# EasyEDA schematic SCH_Party-Lights_2024-05-11.json
TITLE: Sheet_1; REV: 1.0; Date: 2024-04-14; Sheet: 1/1; Drawn By: saisiddharthgiis; Company: Your Company
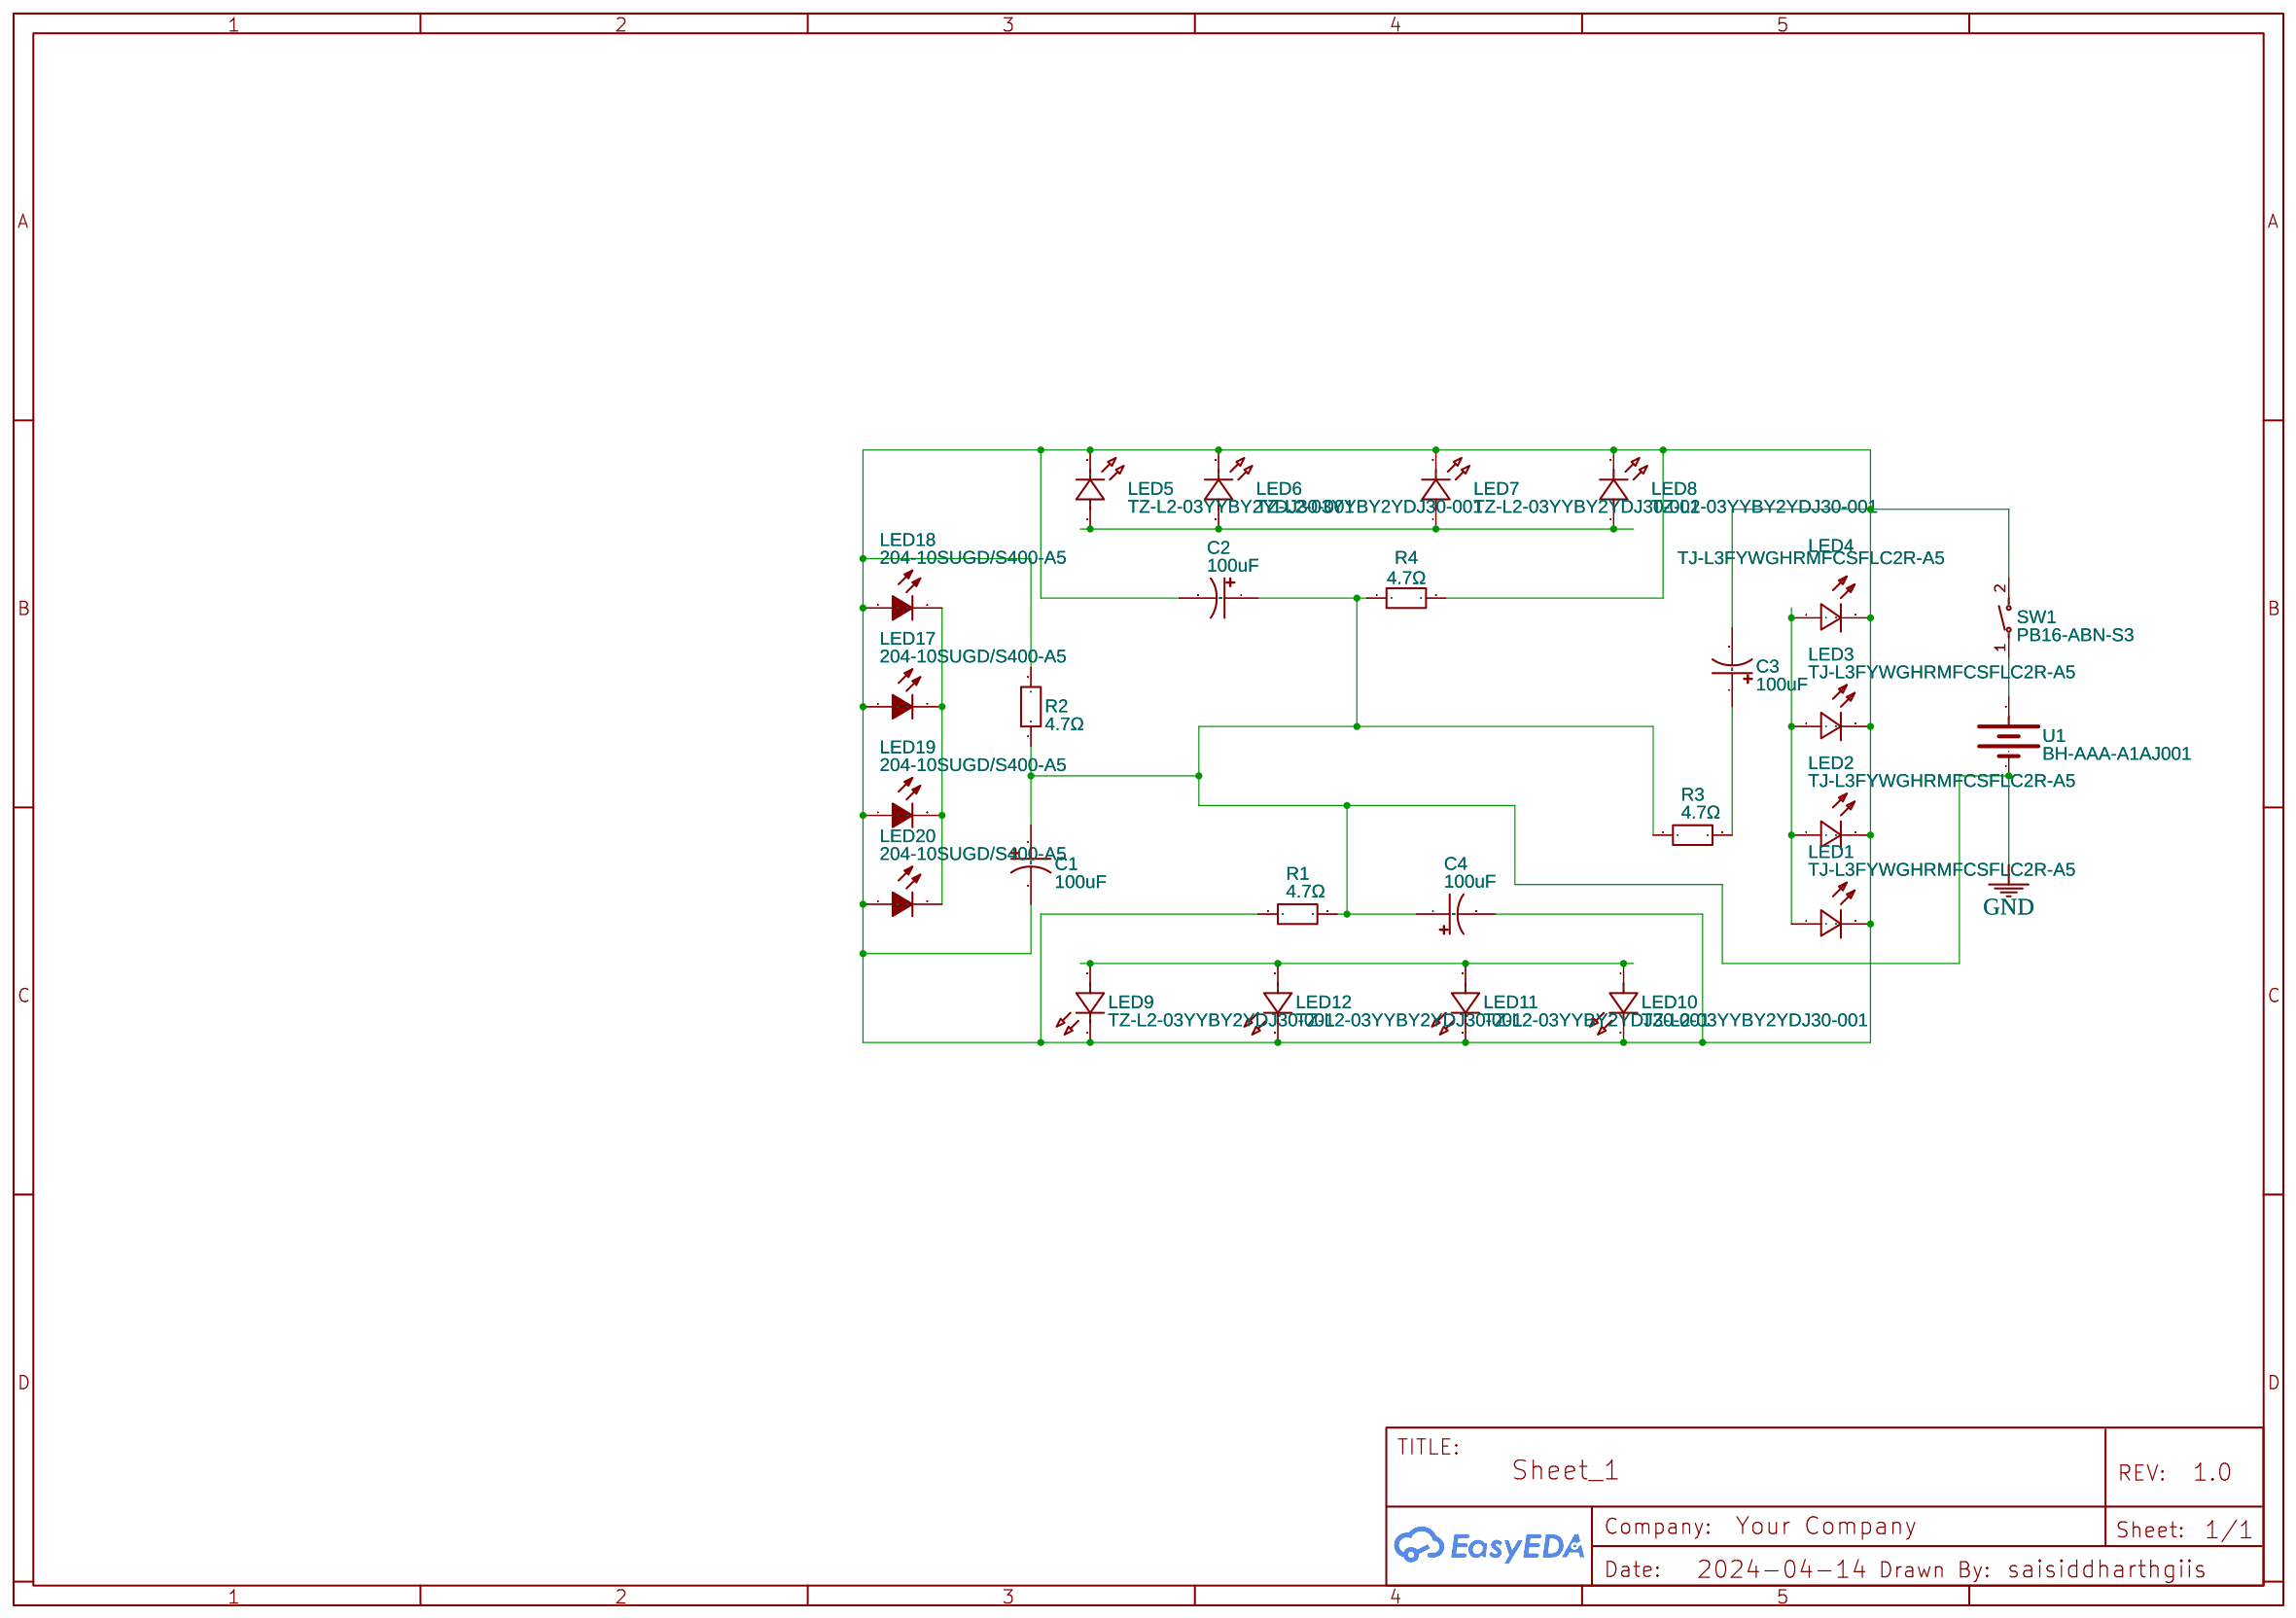
[diagram p0: schematic sheet]

## Parts
C1  100uF  [CASE-A_3216]
C2  100uF  [CASE-A_3216]
C3  100uF  [CASE-A_3216]
C4  100uF  [CASE-A_3216]
LED1  TJ-L3FYWGHRMFCSFLC2R-A5  [LED-TH_BD3.0-P2.54-FD]
LED2  TJ-L3FYWGHRMFCSFLC2R-A5  [LED-TH_BD3.0-P2.54-FD]
LED3  TJ-L3FYWGHRMFCSFLC2R-A5  [LED-TH_BD3.0-P2.54-FD]
LED4  TJ-L3FYWGHRMFCSFLC2R-A5  [LED-TH_BD3.0-P2.54-FD]
LED5  TZ-L2-03YYBY2YDJ30-001  [LED-TH_BD3.0-P2.54-FD_YELLOW]
LED6  TZ-L2-03YYBY2YDJ30-001  [LED-TH_BD3.0-P2.54-FD_YELLOW]
LED7  TZ-L2-03YYBY2YDJ30-001  [LED-TH_BD3.0-P2.54-FD_YELLOW]
LED8  TZ-L2-03YYBY2YDJ30-001  [LED-TH_BD3.0-P2.54-FD_YELLOW]
LED9  TZ-L2-03YYBY2YDJ30-001  [LED-TH_BD3.0-P2.54-FD_YELLOW]
LED10  TZ-L2-03YYBY2YDJ30-001  [LED-TH_BD3.0-P2.54-FD_YELLOW]
LED11  TZ-L2-03YYBY2YDJ30-001  [LED-TH_BD3.0-P2.54-FD_YELLOW]
LED12  TZ-L2-03YYBY2YDJ30-001  [LED-TH_BD3.0-P2.54-FD_YELLOW]
LED17  204-10SUGD/S400-A5  [LED-TH_BD3.0-P2.54-FD-GREEN]
LED18  204-10SUGD/S400-A5  [LED-TH_BD3.0-P2.54-FD-GREEN]
LED19  204-10SUGD/S400-A5  [LED-TH_BD3.0-P2.54-FD-GREEN]
LED20  204-10SUGD/S400-A5  [LED-TH_BD3.0-P2.54-FD-GREEN]
R1  4.7Ω  [R0402]
R2  4.7Ω  [R0402]
R3  4.7Ω  [R0402]
R4  4.7Ω  [R0402]
SW1  PB16-ABN-S3  [SW-TH_D-SWITCH_PB16-ABN-S3]
U1  BH-AAA-A1AJ001  [BAT-TH_BH-AAA-A1AJ001]

## Library data of the parts
C1-C4 = TLJA107M010R1400: Contributor: LCSC; Supplier: LCSC; Supplier Part: C313517; Manufacturer: Kyocera AVX; JLCPCB Part Class: Extended Part
LED1-LED4 = TJ-L3FYWGHRMFCSFLC2R-A5: Contributor: LCSC; Supplier: LCSC; Supplier Part: C331041; Manufacturer: TOGIALED(统佳); JLCPCB Part Class: Extended Part
LED5-LED12 = TZ-L2-03YYBY2YDJ30-001: Contributor: LCSC; Supplier: LCSC; Supplier Part: C779430; Manufacturer: TUOZHAN(拓展光电)
LED17-LED20 = 204-10SUGD/S400-A5: Supplier: LCSC; Manufacturer: EVERLIGHT(亿光); Supplier Part: C99761; JLCPCB Part Class: Extended Part
R1-R4 = AF0402FR-074R7L: Contributor: LCSC; Supplier: LCSC; Supplier Part: C723505; Manufacturer: YAGEO(国巨); JLCPCB Part Class: Extended Part
SW1 = PB16-ABN-S3: Contributor: LCSC; Supplier: LCSC; Supplier Part: C2981365; Manufacturer: D-SWITCH(德崧); JLCPCB Part Class: Extended Part
U1 = BH-AAA-A1AJ001: Supplier: LCSC; Supplier Part: C5290189; Manufacturer: MYOUNG(美阳); JLCPCB Part Class: Extended Part; Contributor: lcsc

## Nets
GND: C1.1 C2.1 C4.1 R1.2 R2.1 R3.1 R4.1 U1.1(-)
Net-(C1-2): C1.2 C2.2 C3.2 C4.2 LED1.2 LED2.2 LED3.2 LED4.2 LED5.2(K) LED6.2(K) LED7.2(K) LED8.2(K) LED9.2(K) LED10.2(K) LED11.2(K) LED12.2(K) LED17.1(A) LED18.1(A) LED19.1(A) LED20.1(A) R1.1 R2.2 R4.2 SW1.2
Net-(C3-1): C3.1 R3.2
Net-(LED1-1): LED1.1 LED2.1 LED3.1 LED4.1
Net-(LED5-1): LED5.1(A) LED6.1(A) LED7.1(A) LED8.1(A)
Net-(LED9-1): LED9.1(A) LED10.1(A) LED11.1(A) LED12.1(A)
Net-(LED17-2): LED17.2(K) LED18.2(K) LED19.2(K) LED20.2(K)
Net-(SW1-1): SW1.1 U1.2(+)
